# Altium schematic sheet No_Inversor.SchDoc
size A
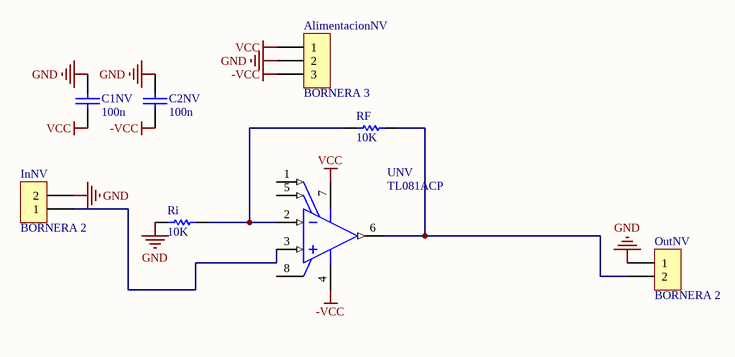
[diagram p0: No_Inversor.SchDoc]

## Parts
AlimentacionNV  BORNERA 3  [BORNERA3]
C1NV  100n  [0805]
C2NV  100n  [0805]
InNV  BORNERA 2  [BORNERA2]
OutNV  BORNERA 2  [BORNERA2]
RF  10K  [0805]
Ri  10K  [0805]
UNV  TL081ACP  [TI-P8]

## Nets
-VCC: AlimentacionNV.3 C2NV.2 UNV.4(VCC-)
GND: AlimentacionNV.2 C1NV.1 C2NV.1 InNV.2 OutNV.1 Ri.1
VCC: AlimentacionNV.1 C1NV.2 UNV.7(VCC+)
NetInNV_1: InNV.1 UNV.3(IN+)
NetOutNV_2: OutNV.2 RF.2 UNV.6(OUT)
NetRF_1: RF.1 Ri.2 UNV.2(IN-)

Not connected (* = marked no-connect by the designer): UNV 1(OFFSET_N1) 5(OFFSET_N2) 8(NC)

## Library data of the parts
C1NV C2NV = CAP
RF Ri = RES
UNV = TL081ACP: JFET-Input Operational Amplifier, 7 to 36 V, 0 to 70 degC, 8-pin DIP (P8), Pb-Free (RoHS); Manufacturer: Texas Instruments; CMRR(Min)(dB): 75; GBW(Typ)(MHz): 3; IIB(Max)(pA): 200; Iq per channel(Max)(mA): 2.8; Number of Channels: 1; Offset Drift(Typ)(uV/C): 18; Rating: Catalog; Slew Rate(Typ)(V/us): 13; Sub Family: General Purpose Amplifier, High Supply Voltage Amplifier (>=30V); Total Supply Voltage(Max)(+5V is 5, +/-5V is 10): 36; Total Supply Voltage(Min)(+5V is 5, +/-5V is 10): 7; Vio (25C)(Max)(mV): 6; DatasheetVersion: SLOS081G; PackageVersion: 4040082/E, 04/2010; PackageReference: P8; PackageDescription: 8-Pin Plastic In-Line, Body 9.59 x 6.35 mm, Pitch 2.54 mm; Supplier 1: Digi-Key; Supplier Part Number 1: 296-7202-5-ND; Supplier 2: Farnell; Supplier Part Number 2: 1133073; Supplier 3: Newark; Supplier Part Number 3: 68K1132; Supplier 4: Mouser; Supplier Part Number 4: 595-TL081ACP; Eco-Plan: Pb-Free (RoHS); Vn at 1kHz(Typ)(nV/rtHz): 18; Mounting Technology: Through Hole; Code_JEDEC: MS-001; PartNumber: TL081ACP; ComponentLink1Description: Manufacturer URL; ComponentLink1URL: http://www.ti.com/; ComponentLink2Description: Datasheet; ComponentLink2URL: http://www.ti.com/lit/ds/symlink/tl081a.pdf; ComponentLink3Description: Package Specification; ComponentLink3URL: http://www.ti.com/litv/pdf/mpdi001b